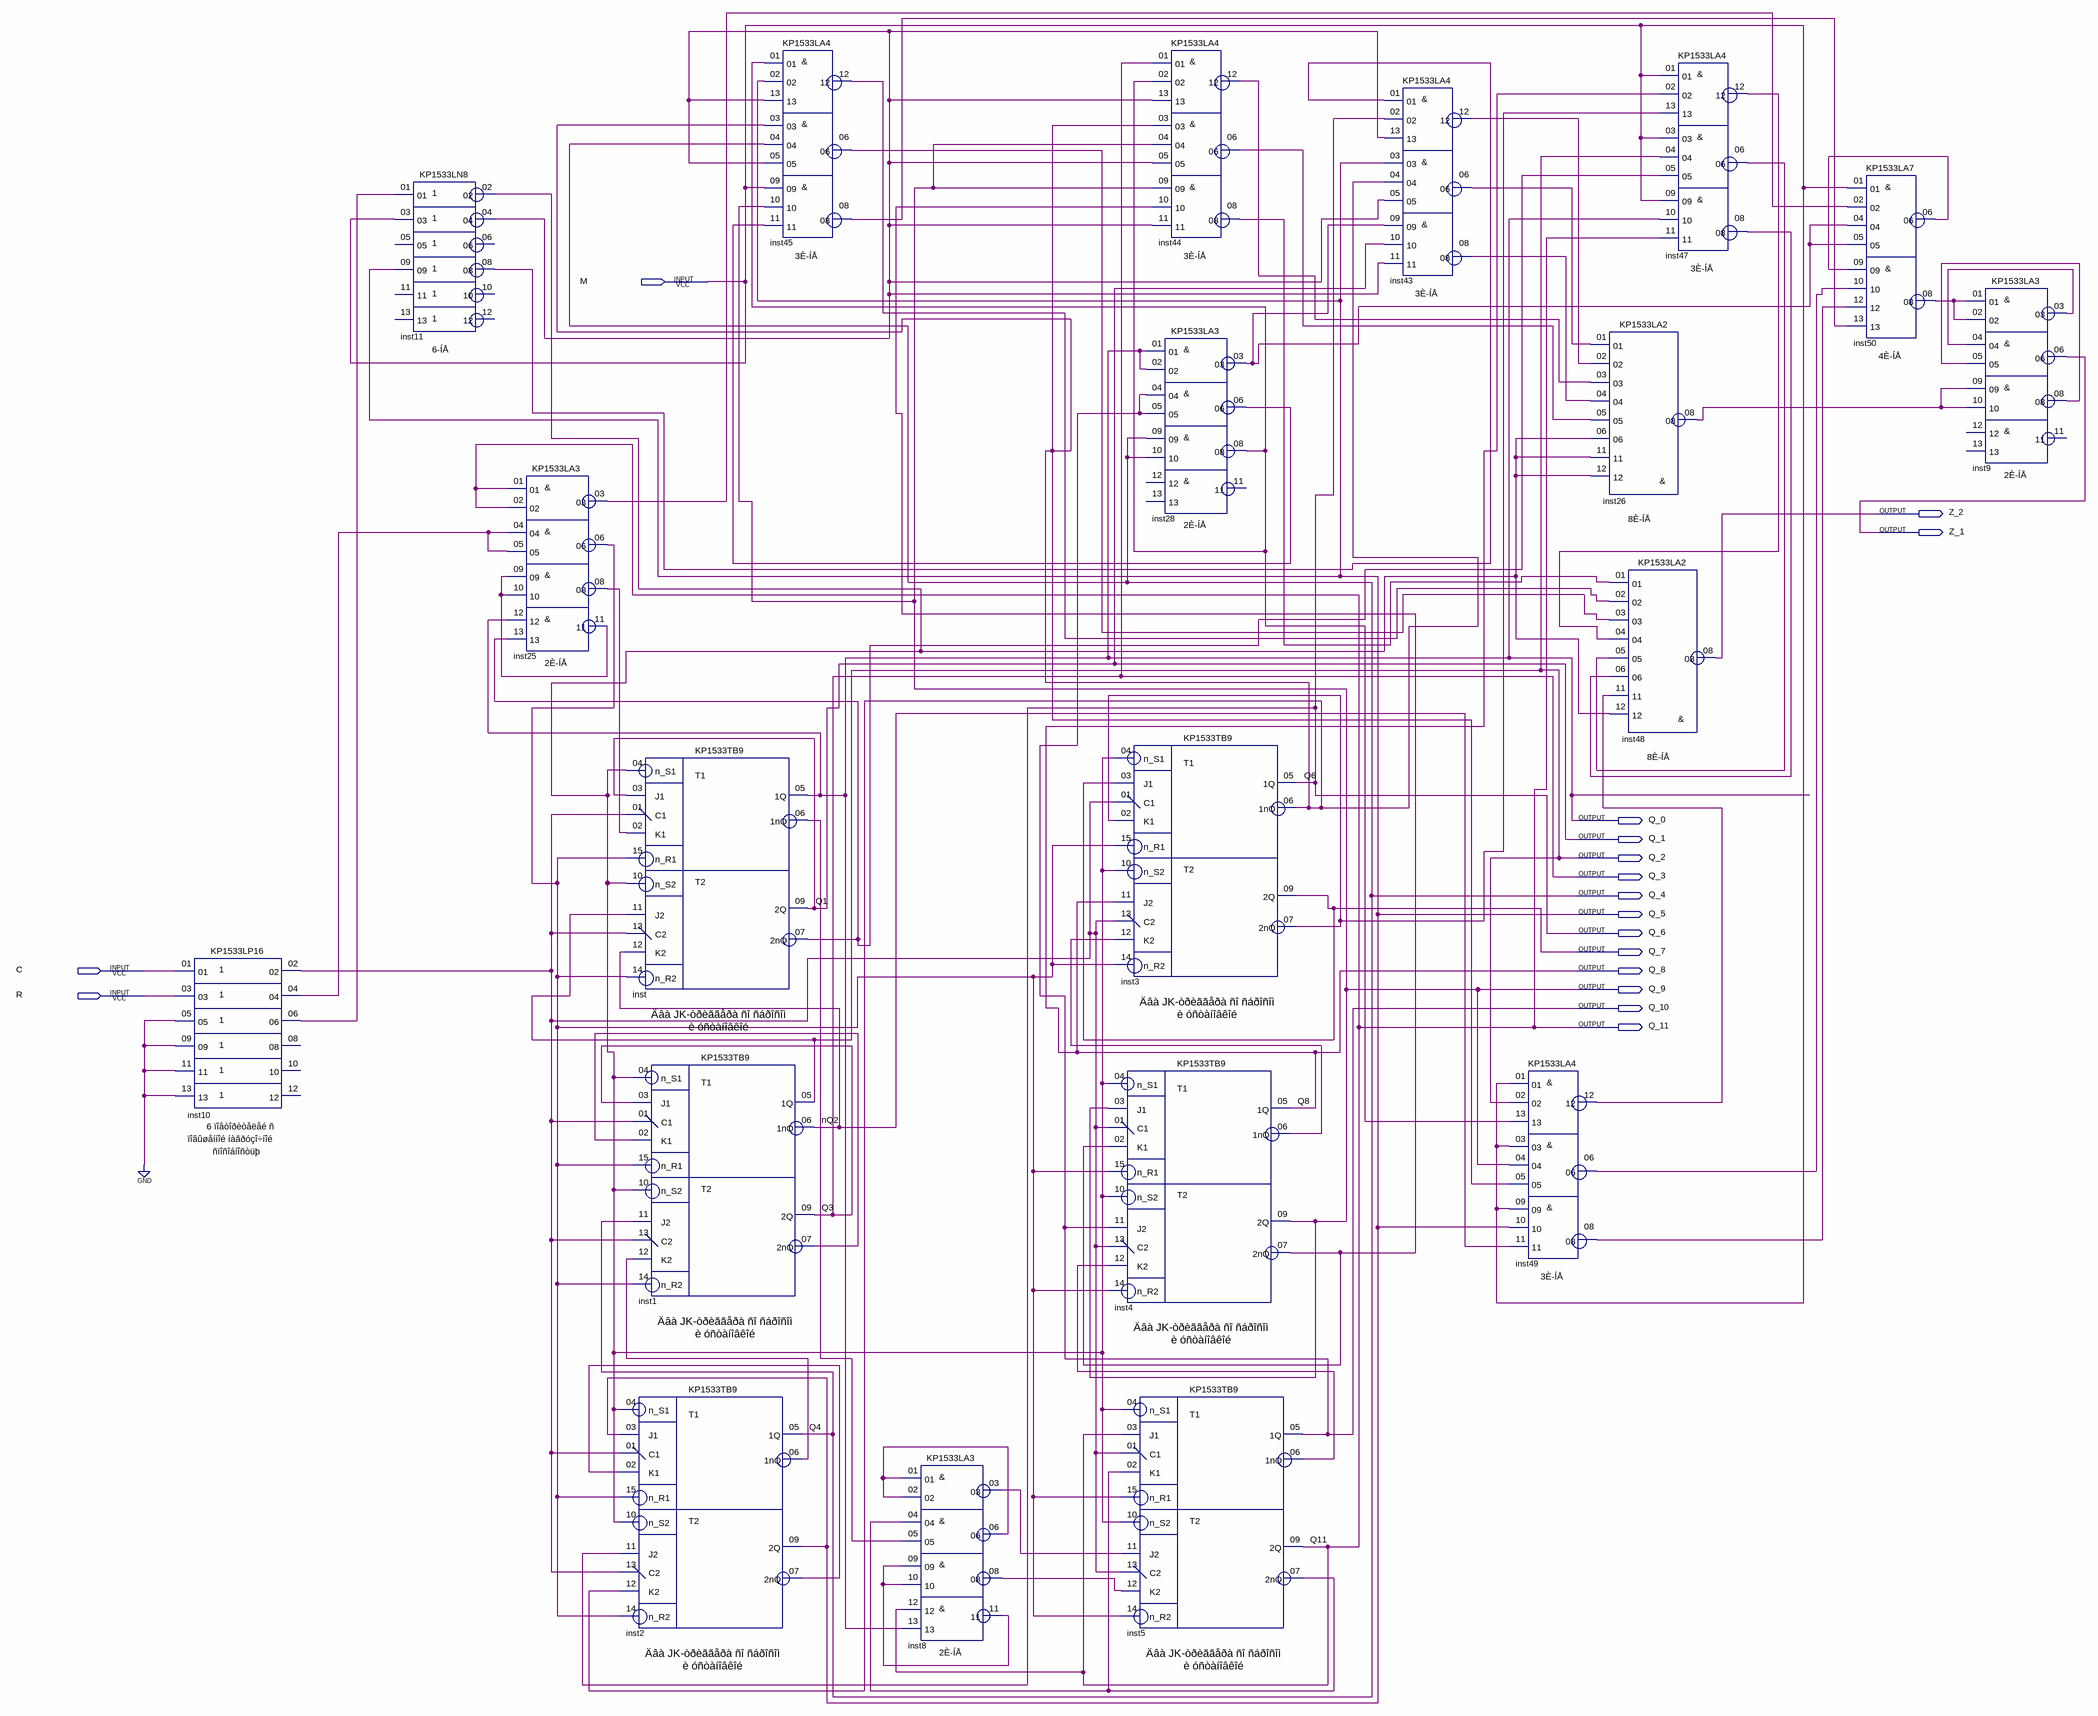
[diagram p0: schematic sheet]
// Quartus schematic Jonson.bdf as structural Verilog: 20 symbols, 17 pins
module Jonson (
  input  M,
  input  C,
  input  R,
  output Z_2,
  output Z_1,
  output Q_0,
  output Q_1,
  output Q_2,
  output Q_3,
  output Q_4,
  output Q_5,
  output Q_6,
  output Q_7,
  output Q_8,
  output Q_9,
  output Q_10,
  output Q_11
);

  wire inst1_2nq, inst2_1nq, inst2_2nq, inst3_1nq, inst3_2nq, inst4_1nq, inst4_2nq, inst5_1nq, inst5_2nq,
       inst8_03, inst8_06, inst8_08, inst8_11, inst9_03, inst9_08, inst10_02, inst10_04, inst10_06,
       inst11_02, inst11_04, inst11_08, inst25_03, inst25_06, inst25_08, inst25_11, inst26_08, inst28_03,
       inst28_06, inst28_08, inst43_06, inst43_08, inst43_12, inst44_06, inst44_08, inst44_12, inst45_06,
       inst45_08, inst45_12, inst47_06, inst47_08, inst47_12, inst49_06, inst49_08, inst49_12, inst50_06,
       inst50_08, inst_1nq, inst_2nq, nQ2;

  KP1533LP16 inst10 (
    .\01 (C), .\03 (R), .\05 (1'b0), .\09 (1'b0), .\11 (1'b0), .\13 (1'b0), .\02 (inst10_02),
    .\04 (inst10_04), .\06 (inst10_06));  // open: 08, 10, 12
  KP1533LN8 inst11 (
    .\01 (inst10_06), .\03 (M), .\09 (Q_5), .\02 (inst11_02), .\04 (inst11_04), .\08 (inst11_08));  // open: 05, 11, 13, 06, 10, 12
  KP1533LA3 inst25 (
    .\01 (Q_11), .\02 (Q_11), .\04 (inst10_04), .\05 (inst10_04), .\09 (inst25_11), .\10 (inst25_11),
    .\12 (Q_0), .\13 (inst_2nq), .\03 (inst25_03), .\06 (inst25_06), .\08 (inst25_08), .\11 (inst25_11));
  KP1533TB9 inst (
    .n_S1(inst11_02), .J1(Q_1), .n_R1(inst25_06), .C1(inst10_02), .K1(inst25_08), .n_S2(inst11_02), .J2(Q_2),
    .n_R2(inst25_06), .C2(inst10_02), .K2(nQ2), .\1Q (Q_0), .\1nQ (inst_1nq), .\2Q (Q_1), .\2nQ (inst_2nq));
  KP1533TB9 inst1 (
    .n_S1(inst11_02), .J1(Q_3), .n_R1(inst25_06), .C1(inst10_02), .K1(inst1_2nq), .n_S2(inst11_02), .J2(Q_4),
    .n_R2(inst25_06), .C2(inst10_02), .K2(inst2_1nq), .\1Q (Q_2), .\1nQ (nQ2), .\2Q (Q_3), .\2nQ (inst1_2nq));
  KP1533TB9 inst2 (
    .n_S1(inst11_02), .J1(Q_5), .n_R1(inst25_06), .C1(inst10_02), .K1(inst2_2nq), .n_S2(inst11_02), .J2(Q_6),
    .n_R2(inst25_06), .C2(inst10_02), .K2(inst3_1nq), .\1Q (Q_4), .\1nQ (inst2_1nq), .\2Q (Q_5),
    .\2nQ (inst2_2nq));
  KP1533LA4 inst45 (
    .\01 (inst28_08), .\02 (Q_5), .\13 (inst11_04), .\03 (inst3_1nq), .\04 (Q_4), .\05 (inst11_04), .\09 (M),
    .\10 (Q_9), .\11 (inst28_06), .\12 (inst45_12), .\06 (inst45_06), .\08 (inst45_08));
  KP1533LA3 inst8 (
    .\01 (inst8_06), .\02 (inst8_06), .\04 (inst5_2nq), .\05 (inst_1nq), .\09 (inst8_11), .\10 (inst8_11),
    .\12 (Q_11), .\13 (Q_0), .\03 (inst8_03), .\06 (inst8_06), .\08 (inst8_08), .\11 (inst8_11));
  KP1533TB9 inst3 (
    .n_S1(inst11_02), .J1(Q_7), .n_R1(inst25_06), .C1(inst10_02), .K1(inst3_2nq), .n_S2(inst11_02), .J2(Q_8),
    .n_R2(inst25_06), .C2(inst10_02), .K2(inst4_1nq), .\1Q (Q_6), .\1nQ (inst3_1nq), .\2Q (Q_7),
    .\2nQ (inst3_2nq));
  KP1533TB9 inst4 (
    .n_S1(inst11_02), .J1(Q_9), .n_R1(inst25_06), .C1(inst10_02), .K1(inst4_2nq), .n_S2(inst11_02),
    .J2(Q_10), .n_R2(inst25_06), .C2(inst10_02), .K2(inst5_1nq), .\1Q (Q_8), .\1nQ (inst4_1nq), .\2Q (Q_9),
    .\2nQ (inst4_2nq));
  KP1533TB9 inst5 (
    .n_S1(inst11_02), .J1(Q_11), .n_R1(inst25_06), .C1(inst10_02), .K1(inst5_2nq), .n_S2(inst11_02),
    .J2(inst8_03), .n_R2(inst25_06), .C2(inst10_02), .K2(inst8_08), .\1Q (Q_10), .\1nQ (inst5_1nq),
    .\2Q (Q_11), .\2nQ (inst5_2nq));
  KP1533LA4 inst44 (
    .\01 (Q_3), .\02 (inst28_08), .\13 (inst11_04), .\03 (inst3_1nq), .\04 (Q_9), .\05 (inst11_04),
    .\09 (Q_9), .\10 (inst4_2nq), .\11 (inst11_04), .\12 (inst44_12), .\06 (inst44_06), .\08 (inst44_08));
  KP1533LA3 inst28 (
    .\01 (Q_0), .\02 (Q_0), .\04 (Q_10), .\05 (Q_10), .\09 (Q_4), .\10 (Q_4), .\03 (inst28_03),
    .\06 (inst28_06), .\08 (inst28_08));  // open: 12, 13, 11
  KP1533LA4 inst43 (
    .\01 (inst11_08), .\02 (Q_6), .\13 (inst11_04), .\03 (Q_5), .\04 (inst3_1nq), .\05 (inst11_04),
    .\09 (inst28_03), .\10 (Q_1), .\11 (inst11_04), .\12 (inst43_12), .\06 (inst43_06), .\08 (inst43_08));
  KP1533LA4 inst49 (
    .\01 (M), .\02 (Q_2), .\13 (inst28_08), .\03 (M), .\04 (Q_9), .\05 (inst3_1nq), .\09 (M), .\10 (Q_5),
    .\11 (nQ2), .\12 (inst49_12), .\06 (inst49_06), .\08 (inst49_08));
  KP1533LA2 inst26 (
    .\01 (inst43_06), .\02 (inst43_12), .\03 (inst44_12), .\04 (inst43_08), .\05 (inst44_06),
    .\06 (inst11_02), .\11 (inst11_02), .\12 (inst11_02), .\08 (inst26_08));
  KP1533LA2 inst48 (
    .\01 (inst44_08), .\02 (inst45_12), .\03 (inst45_06), .\04 (inst47_12), .\05 (inst47_06),
    .\06 (inst47_08), .\11 (inst49_12), .\12 (inst11_02), .\08 (Z_2));
  KP1533LA4 inst47 (
    .\01 (M), .\02 (Q_8), .\13 (inst3_2nq), .\03 (M), .\04 (Q_2), .\05 (inst_2nq), .\09 (M), .\10 (Q_0),
    .\11 (Q_11), .\12 (inst47_12), .\06 (inst47_06), .\08 (inst47_08));
  KP1533LA7 inst50 (
    .\01 (M), .\02 (inst25_03), .\04 (inst28_03), .\05 (inst28_03), .\09 (inst50_06), .\10 (inst49_06),
    .\12 (inst49_08), .\13 (inst45_08), .\06 (inst50_06), .\08 (inst50_08));
  KP1533LA3 inst9 (
    .\01 (inst50_08), .\02 (inst50_08), .\04 (inst9_03), .\05 (inst9_08), .\09 (inst26_08), .\10 (inst26_08),
    .\03 (inst9_03), .\06 (Z_1), .\08 (inst9_08));  // open: 12, 13, 11

  // Other names for the same wires on the sheet: Q1 = Q_1; Q6 = Q_6; Q8 = Q_8; Q3 = Q_3; Q4 = Q_4; Q11 = Q_11
endmodule
